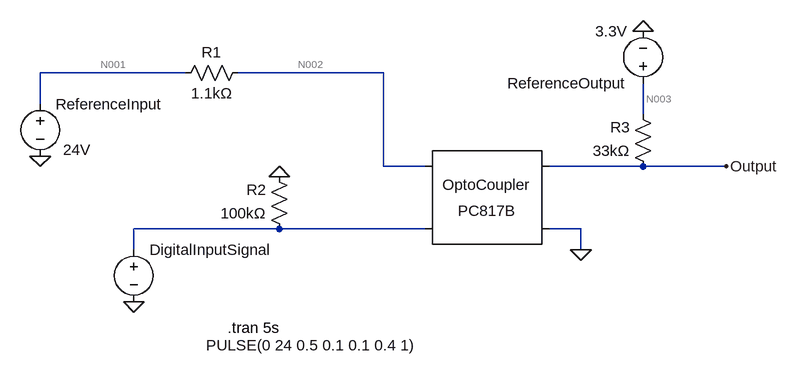
[diagram p0: schematic Conversao_24-3.3.asc]
Conversao_24-3.3.asc, the LTspice schematic file:
Version 4
SHEET 1 984 680
WIRE -192 -64 -416 -64
WIRE 112 -64 -112 -64
WIRE -416 -16 -416 -64
WIRE 512 0 512 -48
WIRE 112 80 112 -64
WIRE 176 80 112 80
WIRE 512 80 368 80
WIRE 640 80 512 80
WIRE -48 176 -272 176
WIRE 176 176 -48 176
WIRE 416 176 368 176
WIRE -272 208 -272 176
WIRE 416 208 416 176
FLAG 416 208 0
FLAG 512 -128 0
FLAG 640 80 Output
FLAG -416 64 0
FLAG -272 288 0
FLAG -48 96 0
SYMBOL Optos\\PC817B 272 128 R0
SYMATTR InstName OptoCoupler
SYMBOL res -96 -80 R90
WINDOW 0 0 56 VBottom 2
WINDOW 3 32 56 VTop 2
SYMATTR InstName R1
SYMATTR Value 1.1kΩ
SYMBOL voltage -272 192 R0
WINDOW 123 0 0 Left 0
WINDOW 39 0 0 Left 0
WINDOW 3 111 163 Left 2
SYMATTR Value PULSE(0 24 0.5 0.1 0.1 0.4 1)
SYMATTR InstName DigitalInputSignal
SYMBOL voltage 512 -32 R180
WINDOW 123 0 0 Left 0
WINDOW 39 0 0 Left 0
SYMATTR InstName ReferenceOutput
SYMATTR Value 3.3V
SYMBOL res 528 96 R180
WINDOW 0 36 76 Left 2
WINDOW 3 36 40 Left 2
SYMATTR InstName R3
SYMATTR Value 33kΩ
SYMBOL voltage -416 -32 R0
WINDOW 123 0 0 Left 0
WINDOW 39 0 0 Left 0
WINDOW 3 35 86 Left 2
SYMATTR Value 24V
SYMATTR InstName ReferenceInput
SYMBOL res -32 192 R180
WINDOW 0 36 76 Left 2
WINDOW 3 36 40 Left 2
SYMATTR InstName R2
SYMATTR Value 100kΩ
TEXT -128 328 Left 2 !.tran 5s

The netlist it stands for:
* Conversao_24-3.3.asc
XOptoCoupler N002 N004 Output 0 PC817 Igain=1.5m
R1 N002 N001 1.1kΩ
V§DigitalInputSignal N004 0 PULSE(0 24 0.5 0.1 0.1 0.4 1)
V§ReferenceOutput N003 0 3.3V
R3 Output N003 33kΩ
V§ReferenceInput N001 0 24V
R2 N004 0 100kΩ
.tran 5s
.lib PC817.sub
.backanno
.end

* Results of the author's LTspice run, read from the files saved beside the schematic
* Operating Point, zero values left out:
*   V(n002) = 1.133 V
*   V(output) = 24.82 mV
*   V(n001) = 24 V
*   V(n003) = 3.3 V
*   I(R1) = -20.79 mA
*   I(R3) = -99.25 µA
*   I(Digitalinputsignal) = 20.79 mA
*   I(Referenceoutput) = -99.25 µA
*   I(Referenceinput) = -20.79 mA
*   Ix(optocoupler:1) = 20.79 mA
*   Ix(optocoupler:2) = -20.79 mA
*   Ix(optocoupler:3) = 99.25 µA
*   Ix(optocoupler:4) = -99.25 µA